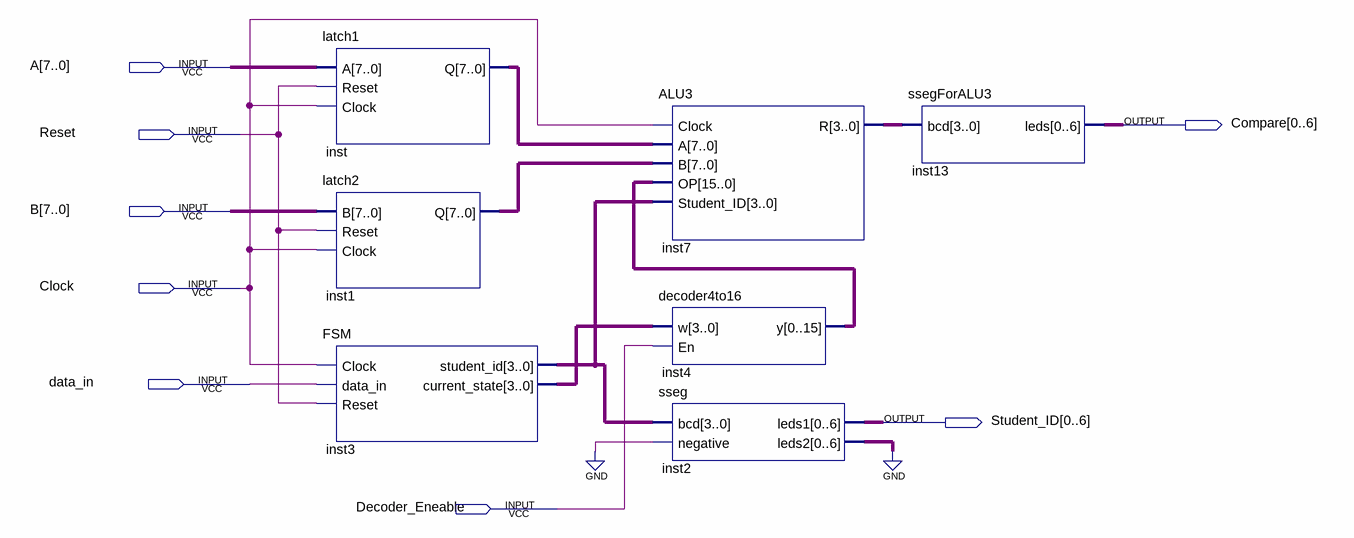
[diagram p0: schematic sheet]
// Quartus schematic Problem3.bdf as structural Verilog: 7 symbols, 8 pins
module Problem3 (
  input  [7:0] A,
  input  Reset,
  input  [7:0] B,
  input  Clock,
  input  data_in,
  input  Decoder_Eneable,
  output [0:6] Compare,
  output [0:6] Student_ID
);

  wire [3:0] inst3_current_state, inst3_student_id, inst7_r;
  wire [6:0] inst2_leds2;
  wire [7:0] inst1_q, inst_q;
  wire [15:0] inst4_y;

  latch1 inst (.A(A), .Reset(Reset), .Clock(Clock), .Q(inst_q));
  latch2 inst1 (.B(B), .Reset(Reset), .Clock(Clock), .Q(inst1_q));
  FSM inst3 (
    .Clock(Clock), .data_in(data_in), .Reset(Reset), .student_id(inst3_student_id),
    .current_state(inst3_current_state));
  ALU3 inst7 (.Clock(Clock), .A(inst_q), .B(inst1_q), .OP(inst4_y), .Student_ID(inst3_student_id), .R(inst7_r));
  decoder4to16 inst4 (.w(inst3_current_state), .En(Decoder_Eneable), .y(inst4_y));
  sseg inst2 (.bcd(inst3_student_id), .negative(1'b0), .leds1(Student_ID), .leds2(inst2_leds2));
  ssegForALU3 inst13 (.bcd(inst7_r), .leds(Compare));
  // also tied to GND on the sheet: {inst2_leds2[0], inst2_leds2[1], inst2_leds2[2], inst2_leds2[3], inst2_leds2[4], inst2_leds2[5], inst2_leds2[6]}
endmodule
